# EAGLE schematic current-sensor (EAGLE 7.6.0)
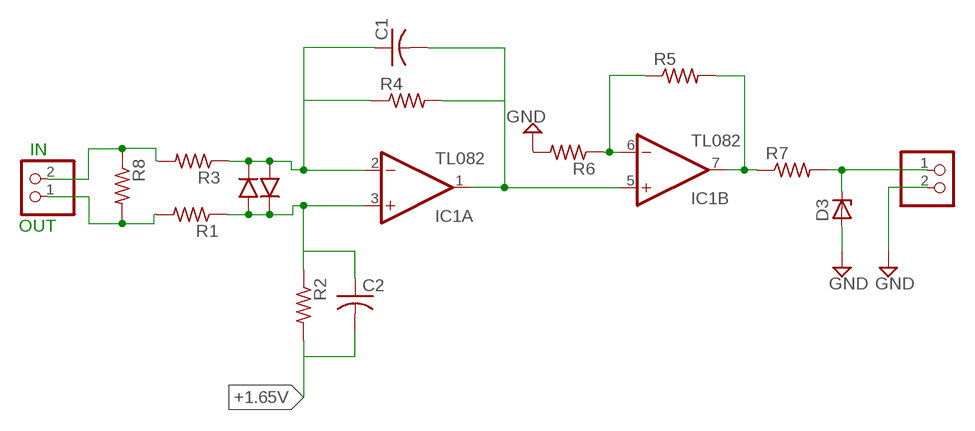
[diagram p0: schematic, sheet 1]

## Parts
C1  C-US025-050X050  [C025-050X050]
C2  C-US025-050X050  [C025-050X050]
D1  1N4004  [DO41-10]
D2  1N4004  [DO41-10]
D3  ZENER-DIODEC1702-15  [C1702-15]
I/P  PINHD-1X2/90  [1X02/90]
IC1  TL082  TL082P  [DIL08]
O/P  PINHD-1X2  [1X02]
R1  R-US_0207/10  [0207/10]
R2  R-US_0207/10  [0207/10]
R3  R-US_0207/10  [0207/10]
R4  R-US_0207/10  [0207/10]
R5  R-US_0207/10  [0207/10]
R6  R-US_0207/10  [0207/10]
R7  R-US_0207/10  [0207/10]
R8  R-US_0207/10  [0207/10]

## Nets
+1.65V: C2.2 R2.2
C1: C1.2 IC1.1(A:OUT) IC1.5(B:+IN) R4.2
GND: D3.A O/P.2 R6.2
N$1: IC1.7(B:OUT) R5.2 R7.1
N$2: I/P.2 R8.1
N$3: IC1.6(B:-IN) R5.1 R6.1
N$4: D3.C O/P.1 R7.2
N$5: C1.1 D1.C D2.A IC1.2(A:-IN) R3.1 R4.1
N$6: C2.1 D1.A D2.C IC1.3(A:+IN) R1.1 R2.1
N$19: I/P.1 R1.2 R8.2
Unconnected: R3.2

## Notes on the sheet
- IN
- OUT

## Power pins joined to a net without a drawn wire
V+: IC1.8(P:V+)
V-: IC1.4(P:V-)

## Library data of the parts
C1 C2 = rcl:C-US: CAPACITOR, American symbol
D1 D2 = diode:1N4004: DIODE general purpose rectifier, 1 A
D3 = diode:ZENER-DIODE: Z-Diode
I/P O/P = pinhead:PINHD-1X2: PIN HEADER
IC1 = linear:TL082: OP AMP Data sheet <http://www.ti.com/lit/ds/symlink/tl084a . pdf>; DATA_SHEET: <a href="http://www.ti.com/lit/ds/symlink/tl084a.pdf"> Data sheet </a>
R1-R8 = rcl:R-US_: RESISTOR, American symbol